# Altium schematic sheet InterfacesWaveyRadar.SchDoc: Interfaces WaveyRadar Schematic
size Letter; Author: Will Vu; CompanyName: Raccoon Wireless; DrawnBy: Will Vu, Raccoon Wireless; Engineer: Will Vu; Organization: Raccoon Wireless; DocumentNumber: 2-14; Revision: 2; SheetNumber: 14; SheetTotal: 15
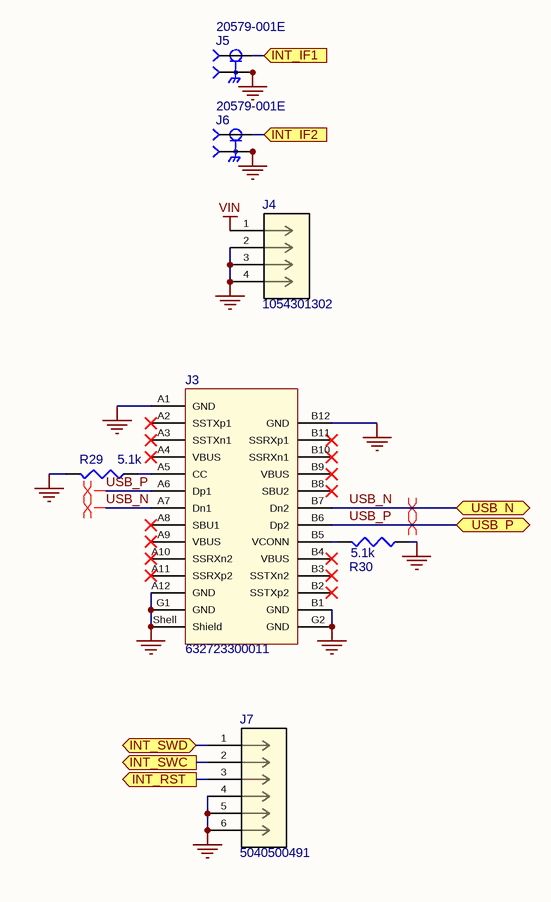
[diagram p0: InterfacesWaveyRadar.SchDoc]

## Parts
J3  632723300011  [632723300011]
J4  1054301302  [CON_1054301302_MOL]
J5  20579-001E  [IPEX_20579-001E]
J6  20579-001E  [IPEX_20579-001E]
J7  5040500491  [CON_5040500491]
R29  value 5.1k  [RESC1005X40X25NL05T05]  (hidden comment: ERJ-2RKF5101X)
R30  value 5.1k  [RESC1005X40X25NL05T05]  (hidden comment: ERJ-2RKF5101X)

## Ports
INT_IF1 (in), INT_IF2 (in), INT_RST (out), INT_SWC (out), INT_SWD (bidir), USB_N (bidir), USB_P (bidir)

## Nets
GND: J3.A1(GND) J3.A12(GND) J3.B1(GND) J3.B12(GND) J3.G1(GND) J3.G2(GND) J3.Shell(Shield) J4.2 J4.3 J4.4 J5.G1(GROUND) J5.G2(GROUND) J5.G3(GROUND) J6.G1(GROUND) J6.G2(GROUND) J6.G3(GROUND) J7.4 J7.5 J7.6 R29.2 R30.1
VIN: J4.1
INT_IF1: J5.1(SIGNAL) ; port INT_IF1
INT_IF2: J6.1(SIGNAL) ; port INT_IF2
INT_RST: J7.3 ; port INT_RST
INT_SWC: J7.2 ; port INT_SWC
INT_SWD: J7.1 ; port INT_SWD
USB_N: J3.A7(Dn1) J3.B7(Dn2) ; port USB_N
USB_P: J3.A6(Dp1) J3.B6(Dp2) ; port USB_P
NetJ3_A5: J3.A5(CC) R29.1
NetJ3_B5: J3.B5(VCONN) R30.2

Not connected (* = marked no-connect by the designer): J3 A2(SSTXp1)* A3(SSTXn1)* A4(VBUS)* A8(SBU1)* A9(VBUS)* A10(SSRXn2)* A11(SSRXp2)* B2(SSTXp2)* B3(SSTXn2)* B4(VBUS)* B8(SBU2)* B9(VBUS)* B10(SSRXn1)* B11(SSRXp1)*

## Layout directives
differential pair: USB_N, USB_P

## Notes on the sheet
- /

## Library data of the parts
J3 = CMP-069-000006-3: USB 3.1 Type C, Receptacle, Horizontal, THR; Manufacturer: Wurth Elektronik; Pin Number: 24; Working Voltage: 20VAC; Interface Type: Type C; Rated Current: 5A; Gender: Receptacle; Mounting Technology: THR; Packaging: Tape and Reel; Type: Horizontal; Operating Temperature: -40 to +105degC; ComponentLink1Description: Manufacturer; ComponentLink1URL: http://www.we-online.de; Published Date: August 2020; ComponentLink2URL: https://katalog.we-online.com/em/datasheet/632723300011.pdf; ComponentLink2Description: Datasheet; Manufacturer Part Number: 632723300011; Application: USB 3.1; Source: WR-USB_USB 3.1.SchLib; Design Item ID: 632723300011
J4 = CMP-035-000000-2: Nano-Fit Right-Angle Header, Surface Mount, 2.50mm Pitch, Single Row, 2 Circuits, 0.76µm Gold (Au) Plating, Black, Glow-Wire Capable; Vendor: Molex Connector Corporation; Built_By: Molex_Team; SourceLibrary: Add_to_database_2021-02-05; Source: 2021-06-03_11-41-49.SchLib; RefDes: RefDes; Copyright: Copyright (C) 2018 Accelerated Designs. All rights reserved; Design Item ID: 1054301302; Type: DEV; Manufacturer_Part_Number: 1054301302
J5 J6 = CMP-041-000000-4: 12GHz RF recepticle with lock; MF: I-PEX; Price: None; Value: *; MP: 20579-001E; Design Item ID: 20579-001E; Availability: Unavailable; Package: None; SnapEDA_Link: https://www.snapeda.com/parts/20579-001E/I-PEX/view-part/4300957/?ref=snap; Source: SnapEDAsch.SchLib
J7 = CMP-086-000000-2: 1.50mm Pitch, Pico-Lock PCB Header, Single Row, Right-Angle, Surface Mount, Gold (Au) Plating, Positive Lock, 4 Circuits, Tape and Reel; Built_By: Molex_Team; SourceLibrary: Add_to_database_2021-03-17; Vendor: Molex Connector Corporation; Copyright: Copyright (C) 2018 Accelerated Designs. All rights reserved; Design Item ID: 5040500491; Source: 2021-07-07_15-40-05.SchLib; Manufacturer_Part_Number: 5040500491; Type: DEV; RefDes: RefDes
R29 R30 = CMP-009-00180-5: PANASONIC - ERJ2RKF5101X - SMD Chip Resistor, 0402 [1005 Metric], 5.1 kohm, ERJ2R Series, 50 V, Thick Film, 100 mW, 5.1k ohm